# Altium schematic sheet PSRAM.SchDoc: RAM
size A4; Revision: 2.0; SheetNumber: 7; SheetTotal: 7; DrawnBy: Dim Su; Engineer: DS; ContentRev1: Original Document; dateREV1: "Aug/31/2018"; dateREV2: "Sep/03/2018"; ContentRev2: Change the caps params; Rev1: V1; Rev2: V2; Project: LET_MAT_3
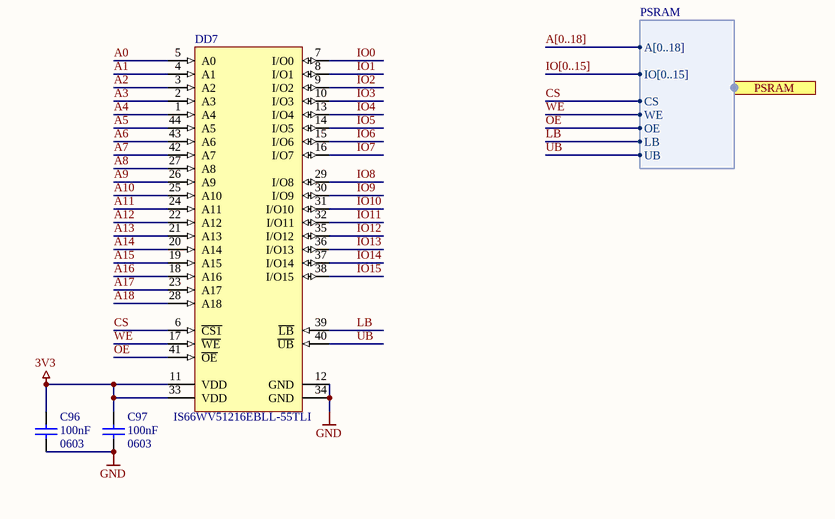
[diagram p0: PSRAM.SchDoc]

## Parts
C96  value 100nF  Package: 0603  [CAPC1608L]  (hidden comment: 100nF / 0603 / X7R / 16V)
C97  value 100nF  Package: 0603  [CAPC1608L]  (hidden comment: 100nF / 0603 / X7R / 16V)
DD7  IS66WV51216EBLL-55TLI  [ISSI-TSOP-2-44_N]

## Ports
PSRAM (harness PSRAM)

## Harnesses
PSRAM: A[0..18], IO[0..15], CS, WE, OE, LB, UB

## Nets
3V3: C96.2 C97.2 DD7.11(VDD) DD7.33(VDD)
GND: C96.1 C97.1 DD7.12(GND) DD7.34(GND)
A0: DD7.5(A0)
A1: DD7.4(A1)
A2: DD7.3(A2)
A3: DD7.2(A3)
A4: DD7.1(A4)
A5: DD7.44(A5)
A6: DD7.43(A6)
A7: DD7.42(A7)
A8: DD7.27(A8)
A9: DD7.26(A9)
A10: DD7.25(A10)
A11: DD7.24(A11)
A12: DD7.22(A12)
A13: DD7.21(A13)
A14: DD7.20(A14)
A15: DD7.19(A15)
A16: DD7.18(A16)
A17: DD7.23(A17)
A18: DD7.28(A18)
CS: DD7.6(~{CS1}) ; port PSRAM.CS
IO0: DD7.7(I/O0)
IO1: DD7.8(I/O1)
IO2: DD7.9(I/O2)
IO3: DD7.10(I/O3)
IO4: DD7.13(I/O4)
IO5: DD7.14(I/O5)
IO6: DD7.15(I/O6)
IO7: DD7.16(I/O7)
IO8: DD7.29(I/O8)
IO9: DD7.30(I/O9)
IO10: DD7.31(I/O10)
IO11: DD7.32(I/O11)
IO12: DD7.35(I/O12)
IO13: DD7.36(I/O13)
IO14: DD7.37(I/O14)
IO15: DD7.38(I/O15)
LB: DD7.39(~{LB}) ; port PSRAM.LB
OE: DD7.41(~{OE}) ; port PSRAM.OE
UB: DD7.40(~{UB}) ; port PSRAM.UB
WE: DD7.17(~{WE}) ; port PSRAM.WE

## Buses and harness runs
bus A[0..18]
bus IO[0..15]

## Notes on the sheet
- Title
- Size:
- Date:
- A4
- Number:
- Time:
- Revision:
- Sheet
- of
- File:

## Library data of the parts
C96 C97 = 100nF / 0603 / X7R / 16V: Capacitor ceramic; Manufacturer: *; Manufacturer Part Number: *; Voltage: 16V; CompName: Capacitor; Price: 0.2
DD7 = IS66WV51216DBLL-55TLI: 8 M Low Voltage, Ultra Low Power Pseudo CMOS SRAM, 512 K x 16, -40 to 85 degC, 44-Pin SOP (TSOP-2-44), Pb-Free; Manufacturer: Integrated Silicon Solution Inc (ISSI); CompName: IC; Organization: 512K x 16; Manufacturer Part Number: IS66WV51216DBLL-55TLI; Price: 2